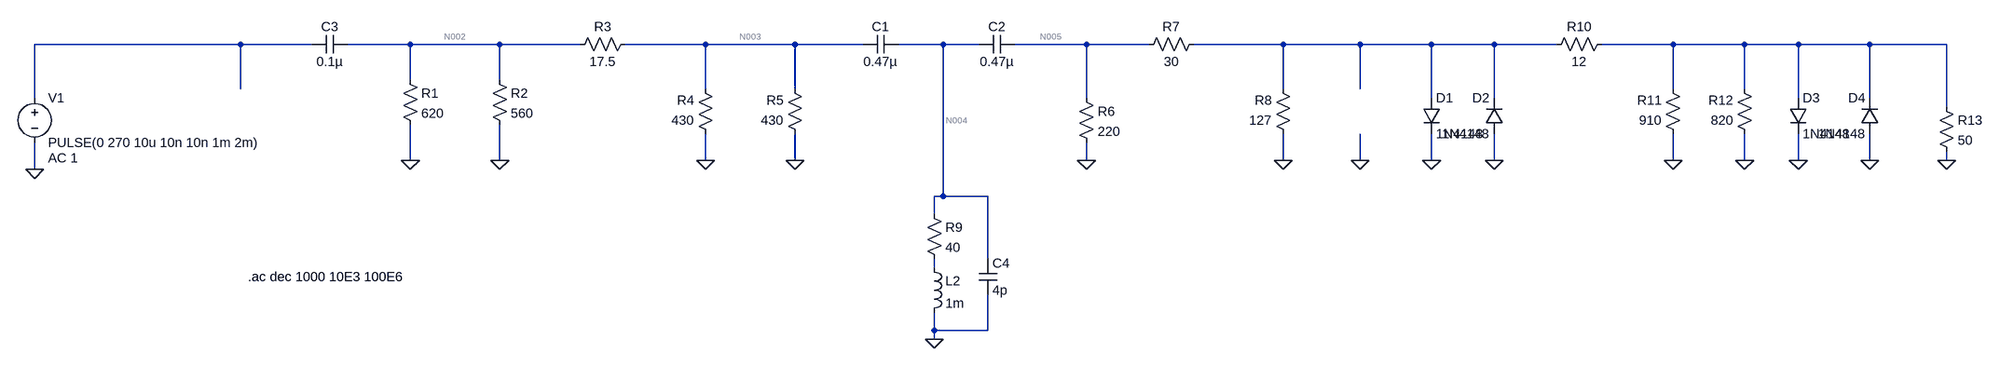
[diagram p0: schematic limiter_ac.asc]
limiter_ac.asc, the LTspice schematic file:
Version 4
SHEET 1 2020 680
WIRE -1200 64 -1568 64
WIRE -1072 64 -1200 64
WIRE -896 64 -1008 64
WIRE -736 64 -896 64
WIRE -592 64 -736 64
WIRE -368 64 -512 64
WIRE -208 64 -368 64
WIRE -80 64 -208 64
WIRE 64 64 -16 64
WIRE 128 64 64 64
WIRE 320 64 192 64
WIRE 432 64 320 64
WIRE 672 64 512 64
WIRE 816 64 672 64
WIRE 944 64 816 64
WIRE 1056 64 944 64
WIRE 1168 64 1056 64
WIRE 1376 64 1248 64
WIRE 1504 64 1376 64
WIRE 1600 64 1504 64
WIRE 1728 64 1600 64
WIRE 1952 64 1728 64
WIRE -896 128 -896 64
WIRE -736 128 -736 64
WIRE -1200 144 -1200 64
WIRE -368 144 -368 64
WIRE -208 144 -208 64
WIRE 672 144 672 64
WIRE 816 144 816 64
WIRE 1376 144 1376 64
WIRE 1504 144 1504 64
WIRE -1568 160 -1568 64
WIRE 320 160 320 64
WIRE 944 160 944 64
WIRE 1056 160 1056 64
WIRE 1600 160 1600 64
WIRE 1728 160 1728 64
WIRE 1952 176 1952 64
WIRE -896 272 -896 208
WIRE -736 272 -736 208
WIRE -368 272 -368 224
WIRE -208 272 -208 224
WIRE 320 272 320 240
WIRE 672 272 672 224
WIRE 816 272 816 224
WIRE 944 272 944 224
WIRE 1056 272 1056 224
WIRE 1376 272 1376 224
WIRE 1504 272 1504 224
WIRE 1600 272 1600 224
WIRE 1728 272 1728 224
WIRE 1952 272 1952 256
WIRE -1568 288 -1568 240
WIRE 64 336 64 64
WIRE 64 336 48 336
WIRE 144 336 64 336
WIRE 48 368 48 336
WIRE 144 448 144 336
WIRE 48 464 48 448
WIRE 48 576 48 544
WIRE 144 576 144 512
WIRE 144 576 48 576
WIRE 48 592 48 576
FLAG -896 272 0
FLAG -736 272 0
FLAG -368 272 0
FLAG -208 272 0
FLAG 320 272 0
FLAG 672 272 0
FLAG 816 272 0
FLAG 944 272 0
FLAG 1056 272 0
FLAG 1376 272 0
FLAG 1504 272 0
FLAG 1600 272 0
FLAG 1728 272 0
FLAG 1952 272 0
FLAG -1568 288 0
FLAG 48 592 0
SYMBOL res -912 112 R0
SYMATTR InstName R1
SYMATTR Value 620
SYMBOL res -752 112 R0
SYMATTR InstName R2
SYMATTR Value 560
SYMBOL res -496 48 R90
WINDOW 0 0 56 VBottom 2
WINDOW 3 32 56 VTop 2
SYMATTR InstName R3
SYMATTR Value 17.5
SYMBOL res -352 240 R180
WINDOW 0 36 76 Left 2
WINDOW 3 36 40 Left 2
SYMATTR InstName R4
SYMATTR Value 430
SYMBOL res -192 240 R180
WINDOW 0 36 76 Left 2
WINDOW 3 36 40 Left 2
SYMATTR InstName R5
SYMATTR Value 430
SYMBOL cap -16 48 R90
WINDOW 0 0 32 VBottom 2
WINDOW 3 32 32 VTop 2
SYMATTR InstName C1
SYMATTR Value 0.47µ
SYMBOL cap 192 48 R90
WINDOW 0 0 32 VBottom 2
WINDOW 3 32 32 VTop 2
SYMATTR InstName C2
SYMATTR Value 0.47µ
SYMBOL res 304 144 R0
SYMATTR InstName R6
SYMATTR Value 220
SYMBOL res 528 48 R90
WINDOW 0 0 56 VBottom 2
WINDOW 3 32 56 VTop 2
SYMATTR InstName R7
SYMATTR Value 30
SYMBOL res 688 240 R180
WINDOW 0 36 76 Left 2
WINDOW 3 36 40 Left 2
SYMATTR InstName R8
SYMATTR Value 127
SYMBOL diode 928 160 R0
SYMATTR InstName D1
SYMATTR Value 1N4148
SYMBOL diode 1072 224 R180
WINDOW 0 24 64 Left 2
WINDOW 3 24 0 Left 2
SYMATTR InstName D2
SYMATTR Value 1N4148
SYMBOL res 1264 48 R90
WINDOW 0 0 56 VBottom 2
WINDOW 3 32 56 VTop 2
SYMATTR InstName R10
SYMATTR Value 12
SYMBOL res 1392 240 R180
WINDOW 0 36 76 Left 2
WINDOW 3 36 40 Left 2
SYMATTR InstName R11
SYMATTR Value 910
SYMBOL res 1520 240 R180
WINDOW 0 36 76 Left 2
WINDOW 3 36 40 Left 2
SYMATTR InstName R12
SYMATTR Value 820
SYMBOL diode 1584 160 R0
SYMATTR InstName D3
SYMATTR Value 1N4148
SYMBOL diode 1744 224 R180
WINDOW 0 24 64 Left 2
WINDOW 3 24 0 Left 2
SYMATTR InstName D4
SYMATTR Value 1N4148
SYMBOL cap -1008 48 R90
WINDOW 0 0 32 VBottom 2
WINDOW 3 32 32 VTop 2
SYMATTR InstName C3
SYMATTR Value 0.1µ
SYMBOL res 1936 160 R0
SYMATTR InstName R13
SYMATTR Value 50
SYMBOL voltage -1568 144 R0
WINDOW 123 24 124 Left 2
WINDOW 39 0 0 Left 0
SYMATTR InstName V1
SYMATTR Value PULSE(0 270 10u 10n 10n 1m 2m)
SYMATTR Value2 AC 1
SYMBOL ind 32 448 R0
SYMATTR InstName L2
SYMATTR Value 1m
SYMBOL res 32 352 R0
SYMATTR InstName R9
SYMATTR Value 40
SYMBOL cap 128 448 R0
SYMATTR InstName C4
SYMATTR Value 4p
TEXT -1186 480 Left 2 !.ac dec 1000 10E3 100E6

The netlist it stands for:
* limiter_ac.asc
R1 N002 0 620
R2 N002 0 560
R3 N003 N002 17.5
R4 0 N003 430
R5 0 N003 430
C1 N004 N003 0.47µ
C2 N005 N004 0.47µ
R6 N005 0 220
R7 N006 N005 30
R8 0 N006 127
D1 N006 0 1N4148
D2 0 N006 1N4148
R10 N007 N006 12
R11 0 N007 910
R12 0 N007 820
D3 N007 0 1N4148
D4 0 N007 1N4148
C3 N002 N001 0.1µ
R13 N007 0 50
V1 N001 0 PULSE(0 270 10u 10n 10n 1m 2m) AC 1
L2 N008 0 1m
R9 N004 N008 40
C4 N004 0 4p
.model D D
.lib standard.dio
.ac dec 1000 10E3 100E6
.backanno
.end

* Results of the author's LTspice run, read from the files saved beside the schematic
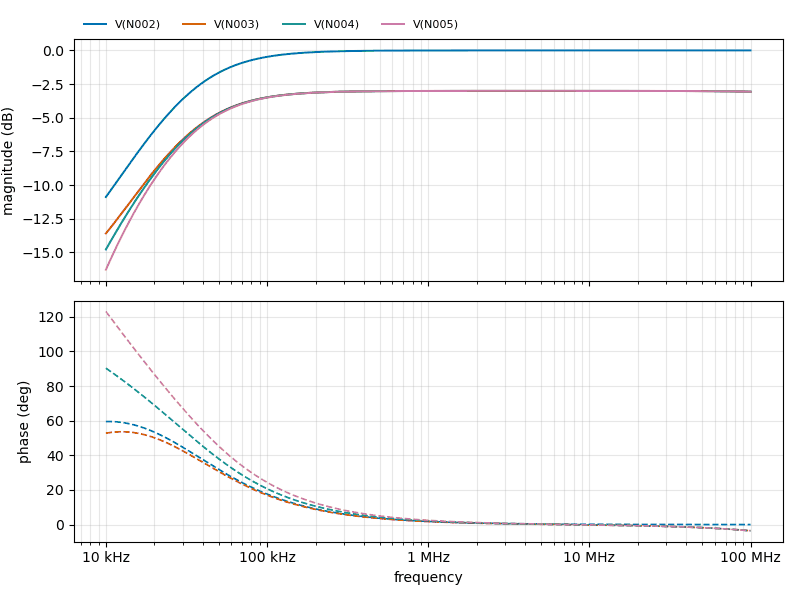
[diagram p1: AC Analysis of limiter_ac.asc, plotted from the saved traces]
* AC Analysis, 1 run:
*   V(N002): -10.89 dB at 10 kHz, -0.00 dB at 100 MHz, peak -0.00 dB at 100 MHz, 3 dB below the peak at 34.18 kHz
*   V(N003): -13.60 dB at 10 kHz, -3.07 dB at 100 MHz, peak -3.01 dB at 5.333 MHz, 3 dB below the peak at 34.12 kHz
*   V(N004): -14.79 dB at 10 kHz, -3.07 dB at 100 MHz, peak -3.01 dB at 5.358 MHz, 3 dB below the peak at 34.64 kHz
*   V(N005): -16.29 dB at 10 kHz, -3.07 dB at 100 MHz, peak -3.01 dB at 5.395 MHz, 3 dB below the peak at 35.75 kHz